# Altium schematic sheet LCD_Schematic.SchDoc
size B
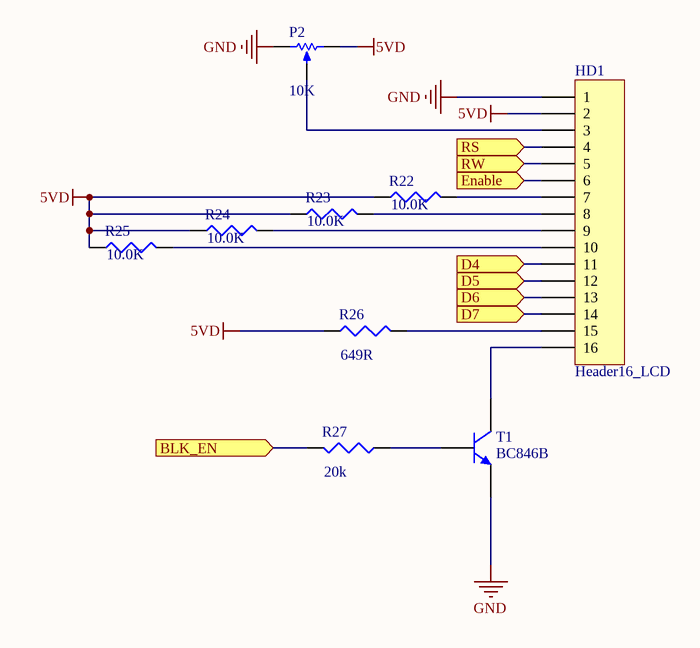
[diagram p0: LCD_Schematic.SchDoc]

## Parts
HD1  Header16_LCD  [HDR1X16_LCD]
P2  value 10K  [BOURNS_3386F]  (hidden comment: RPot)
R22  value 10.0K  [RESC2112X05M]  (hidden comment: Res3)
R23  value 10.0K  [RESC2112X05M]  (hidden comment: Res3)
R24  value 10.0K  [RESC2112X05M]  (hidden comment: Res3)
R25  value 10.0K  [RESC2112X05M]  (hidden comment: Res3)
R26  value 649R  [RESC2112X05M]  (hidden comment: Res3)
R27  value 20k  [RESC2112X05M]  (hidden comment: Res3)
T1  BC846B  [SOT95P230X110-3M]

## Ports
BLK_EN (in), D4 (in), D5 (in), D6 (in), D7 (in), Enable (in), RS (in), RW (in)

## Nets
5VD: HD1.2 P2.3(BOT) R22.1 R23.1 R24.1 R25.1 R26.1
GND: HD1.1 P2.1(TOP) T1.2(E)
BLK_EN: R27.2 ; port BLK_EN
D4: HD1.11 ; port D4
D5: HD1.12 ; port D5
D6: HD1.13 ; port D6
D7: HD1.14 ; port D7
Enable: HD1.6 ; port Enable
RS: HD1.4 ; port RS
RW: HD1.5 ; port RW
NetHD1_3: HD1.3 P2.2(TAP)
NetHD1_7: HD1.7 R22.2
NetHD1_8: HD1.8 R23.2
NetHD1_9: HD1.9 R24.2
NetHD1_10: HD1.10 R25.2
NetHD1_15: HD1.15 R26.2
NetHD1_16: HD1.16 T1.3(C)
NetR27_1: R27.1 T1.1(B)

## Notes on the sheet
- ESE
- is the sole property of ESE. Any reproduction
- The Information Contained in this drawing
- Schematic P/N and Name
- Sheet Name
- 299 Doon Valley Drive
- Kitchener, ON N2G 4M4
- Canada
- Approved
- in part or in whole without the written
- permission of ESE is strictly prohibited.
- APPROVALS
- DATE
- Size
- Scale
- B
- NTS
- Bare PCB P/N
- Date
- Sheet
- Rev.
- Checked
- Engineer
- of

## Library data of the parts
HD1 = Header16_LCD: Header, 16-Pin Female; PN: S7049-ND; URL: http://www.digikey.ca/product-detail/en/PPPC161LFBN-RC/S7049-ND/810188
P2 = RPot: Potentiometer; Sim Note: Enter the Resistance value and the set point into parameter fields.; Set Position: 0.5; PN: 3352T-103LF-ND; Published: 8-Jun-2000; LatestRevisionDate: 17-Jul-2002; LatestRevisionNote: Re-released for DXP Platform.; PackageReference: VR5; Publisher: Altium Limited; PackageDescription: Variable Resistor, Thru-Hole; 3 Leads; URL: http://www.digikey.ca/product-detail/en/3352T-1-103LF/3352T-103LF-ND/1088341
R22-R25 = Resistor_10.0K: RES SMD 10.0K OHM 1% 1/8W 0805; MPN: CRCW080510K0FKEA; PN: 541-10.0KCCT-ND; Name: Resistor_10.0K; URL: http://www.digikey.ca/product-detail/en/CRCW080510K0FKEA/541-10.0KCCT-ND
R26 = Resistor_649R: RES SMD 649R OHM 1% 1/8W 0805; MPN: CRCW0805649RFKEA; PN: 541-649CCT-ND; Name: Resistor_649R; URL: http://www.digikey.ca/product-detail/en/CRCW0805649RFKEA/541-649CCT-ND
R27 = Resistor_1.00K: RES SMD 1.00K OHM 1% 1/8W 0805; MPN: CRCW08051K00FKEA; PN: 541-1.00KCCT-ND; Name: Resistor_1.00K; URL: http://www.digikey.ca/product-detail/en/CRCW08051K00FKEA/541-1.00KCCT-ND
T1 = BC846B: NPN General Purpose Amplifier; PN: 568-1632-1-ND; URL: http://www.digikey.ca/product-detail/en/BC846B,215/568-1632-1-ND/763459